# EAGLE design gest-mod (EAGLE 7.5.0)
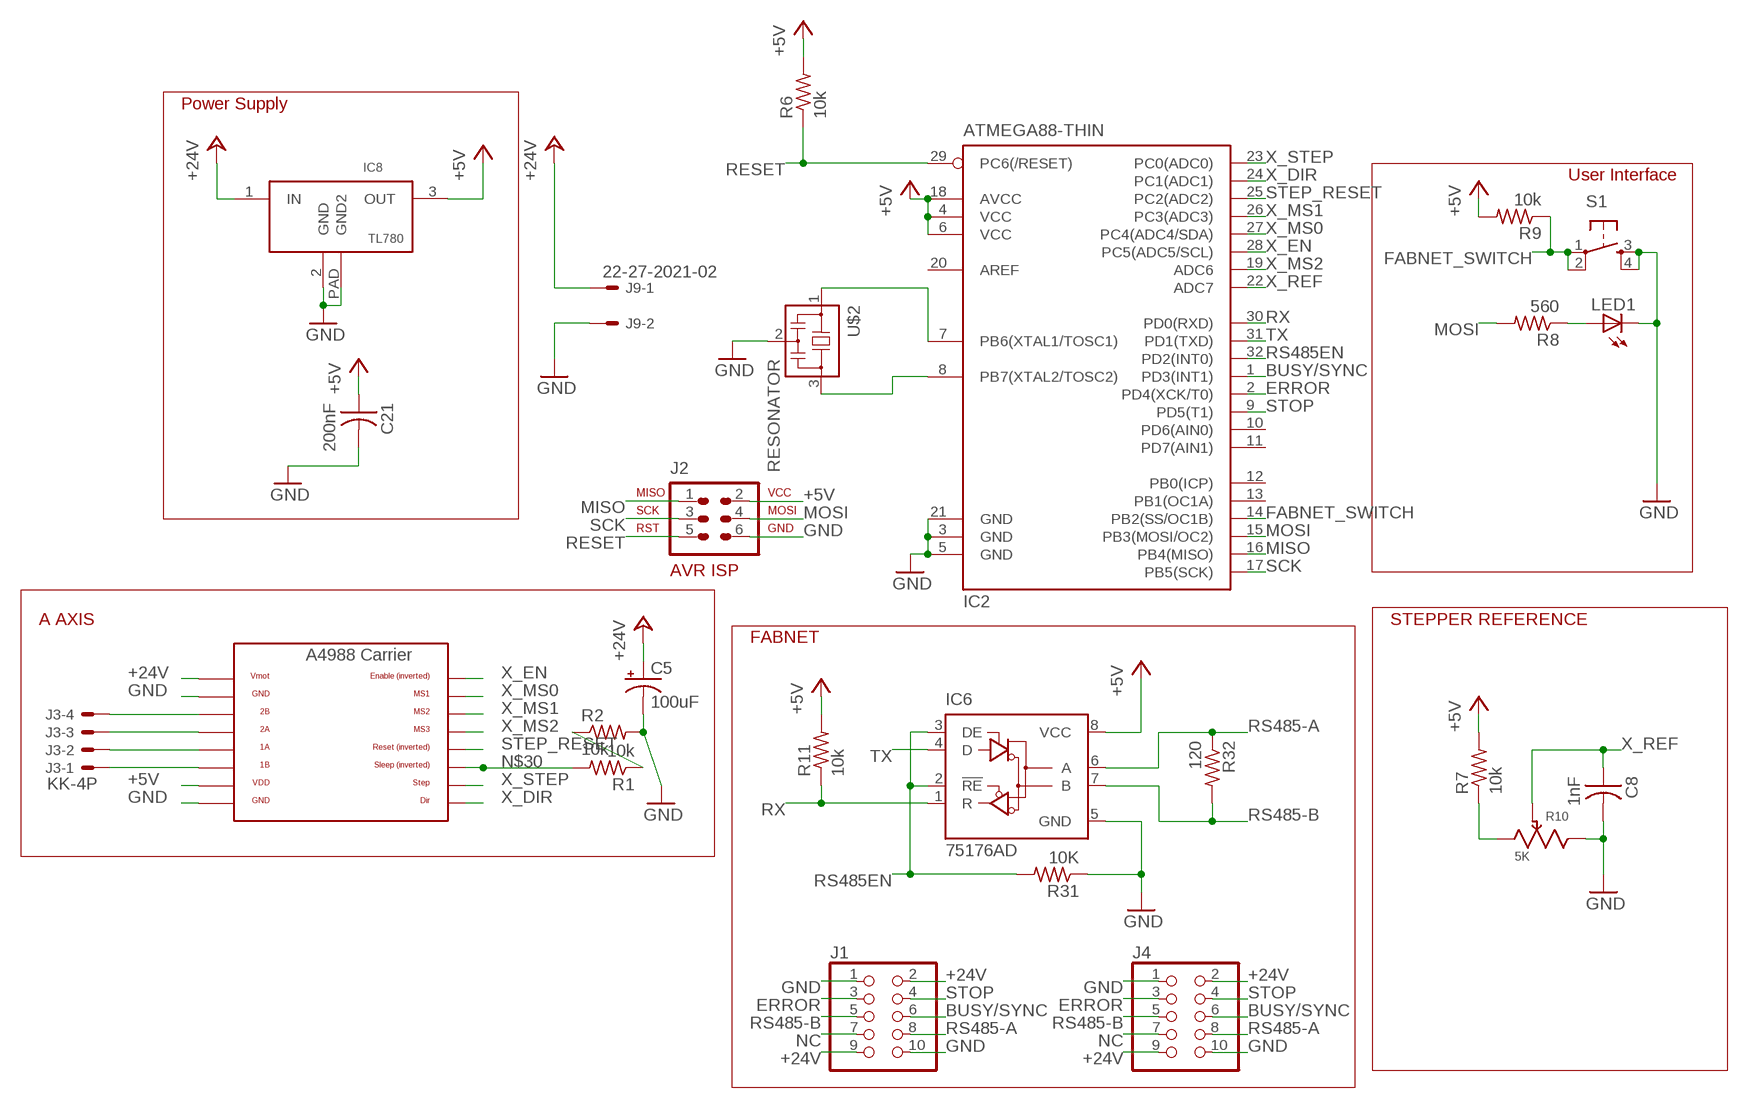
[diagram p0: schematic, sheet 1]

## Parts
C5  100uF  CPOL-USD  [PANASONIC_D]
C8  1nF  CAP-US1206FAB  [C1206FAB]
C21  200nF  CAP-US1206FAB  [C1206FAB]
IC2  ATMEGA88-THIN  [TQFP32-08THIN]
IC6  75176AD  [D_R-PDSO-G8]
IC8  TL780_VREG  [D2PAK-3]
J1  PINHEAD_PINHD-2X5  [PINHEAD_2X05]
J2  AVR-7_AVR-ISP-6VERT  [AVR-7_AVR-ISP-6]
J3  KK-4P  22-05-7048-04  [7395-04]
J4  PINHEAD_PINHD-2X5  [PINHEAD_2X05]
J9  22-27-2021-02  [6410-02]
LED1  LEDCHIPLED_1206  [CHIPLED_1206]
R1  10k  RES-US1206FAB  [R1206FAB]
R2  10k  RES-US1206FAB  [R1206FAB]
R6  10k  RES-US1206FAB  [R1206FAB]
R7  10k  RES-US1206FAB  [R1206FAB]
R8  560  RES-US1206FAB  [R1206FAB]
R9  10k  RES-US1206FAB  [R1206FAB]
R10  5K  BOURN_POT  [BOURN_TRIM]
R11  10k  RES-US1206FAB  [R1206FAB]
R31  10K  RES-US1206FAB  [R1206FAB]
R32  120  RES-US1206FAB  [R1206FAB]
S1  6MM_SWITCH6MM_SWITCH  [6MM_SWITCH]
U$2  RESONATOR  [EFOBM]
U$5  REPRAPJR_A4988BREAKOUT  [REPRAPJR_A4988BREAKOUT]

## Nets
+5V: C21.1 IC2.4(VCC) IC2.6(VCC) IC2.18(AVCC) IC6.8(VCC) IC8.3(OUT) J2.2 R6.2 R7.2 R9.2 R11.2 U$5.VDD
+24V: C5.+ IC8.1(IN) J1.2 J1.9 J4.2 J4.9 J9.1 U$5.VMOT
BUSY/SYNC: IC2.1(PD3(INT1)) J1.6 J4.6
ERROR: IC2.2(PD4(XCK/T0)) J1.3 J4.3
FABNET_SWITCH: IC2.14(PB2(SS/OC1B)) R9.1 S1.1(P) S1.2(P1)
GND: C5.- C8.2 C21.2 IC2.3(GND) IC2.5(GND) IC2.21(GND) IC6.5(GND) IC8.2(GND) IC8.PAD(GND2) J1.1 J1.10 J2.6 J4.1 J4.10 J9.2 LED1.C R2.2 R10.3 R31.1 S1.3(S) S1.4(S1) U$2.2 U$5.GND U$5.GND@0(GND)
MISO: IC2.16(PB4(MISO)) J2.1
MOSI: IC2.15(PB3(MOSI/OC2)) J2.4 R8.2
N2354: R7.1 R10.1
N$1: IC2.7(PB6(XTAL1/TOSC1)) U$2.1
N$2: IC2.8(PB7(XTAL2/TOSC2)) U$2.3
N$3: J3.3 U$5.2A
N$4: J3.4 U$5.2B
N$5: LED1.A R8.1
N$6: R1.1 R2.1
N$7: J3.2 U$5.1A
N$8: J3.1 U$5.1B
N$30: R1.2 U$5.SLP(SLEEP)
NC: J1.7 J4.7
RESET: IC2.29(PC6(/RESET)) J2.5 R6.1
RS485-A: IC6.6(A) J1.8 J4.8 R32.1
RS485-B: IC6.7(B) J1.5 J4.5 R32.2
RS485EN: IC2.32(PD2(INT0)) IC6.2(!RE) IC6.3(DE) R31.2
RX: IC2.30(PD0(RXD)) IC6.1(R) R11.1
SCK: IC2.17(PB5(SCK)) J2.3
STEP_RESET: IC2.25(PC2(ADC2)) U$5.RST
STOP: IC2.9(PD5(T1)) J1.4 J4.4
TX: IC2.31(PD1(TXD)) IC6.4(D)
X_DIR: IC2.24(PC1(ADC1)) U$5.DIR
X_EN: IC2.28(PC5(ADC5/SCL)) U$5.EN
X_MS0: IC2.27(PC4(ADC4/SDA)) U$5.MS1
X_MS1: IC2.26(PC3(ADC3)) U$5.MS2
X_MS2: IC2.19(ADC6) U$5.MS3
X_REF: C8.1 IC2.22(ADC7) R10.2
X_STEP: IC2.23(PC0(ADC0)) U$5.STEP
Unconnected: IC2.10(PD6(AIN0)) IC2.11(PD7(AIN1)) IC2.12(PB0(ICP)) IC2.13(PB1(OC1A)) IC2.20(AREF)

## Notes on the sheet
- Power Supply
- User Interface
- A AXIS | STEPPER REFERENCE
- FABNET

## Library data of the parts
C5 = rcl:CPOL-US: POLARIZED CAPACITOR, American symbol
C8 C21 = fab:CAP-US
IC2 = fab:ATMEGA88-THIN
IC6 = 751xx:75176A: DIFFERENTIAL BUS TRANSCEIVER Source: http://focus.ti.com/lit/ds/symlink/sn75176a.pdf
IC8 = MtMM:TL780_VREG
J1 J4 = fork0.1:PINHEAD_PINHD-2X5: PIN HEADER
J2 = fork0.1:AVR-7_AVR-ISP-6: AVR ISP-6 Serial Programming Header
J3 = con-molex:22-?-04: CONNECTOR wire to board 2.54 mm (.1 inch) pitch header; OC_FARNELL: unknown; OC_NEWARK: unknown
J9 = con-molex:22-?-02: CONNECTOR wire to board 2.54 mm (.1 inch) pitch header; OC_FARNELL: unknown; OC_NEWARK: unknown
LED1 = led:LED: LED OSRAM: - CHIPLED LG R971, LG N971, LY N971, LG Q971, LY Q971, LO R971, LY R971 LH N974, LH R974 LS Q976, LO Q976, LY Q976 LO Q996 - Hyper CHIPLED LW Q18S LB Q993, LB Q99A, LB R99A - SideLED LS A670, LO A670, LY A670, LG A670, LP A670 LB A673, LV A673, LT A673, LW A673 LH A674 LY A675 LS A676, LA A676, LO A676, LY A676, LW A676 LS A679, LY A679, LG A679 - Hyper Micro SIDELED® LS Y876, LA Y876, LO Y876, LY Y876 LT Y87S - SmartLED LW L88C, LW L88S LB L89C, LB L89S, LG L890 LS L89K, LO L89K, LY L89K LS L896, LA L896, LO L896, LY L896 - TOPLED LS T670, LO T670, LY T670, LG T670, LP T670 LSG T670, LSP T670, LSY T670, LOP T670, LYG T670 LG T671, LOG T671, LSG T671 LB T673, LV T673, LT T673, LW T673 LH T674 LS T676, LA T676, LO T676, LY T676, LB T676, LH T676, LSB T676, LW T676 LB T67C, LV T67C, LT T67C, LS T67K, LO T67K, LY T67K, LW E67C LS E67B, LA E67B, LO E67B, LY E67B, LB E67C, LV E67C, LT E67C LW T67C LS T679, LY T679, LG T679 LS T770, LO T770, LY T770, LG T770, LP T770 LB T773, LV T773, LT T773, LW T773 LH T774 LS E675, LA E675, LY E675, LS T675 LS T776, LA T776, LO T776, LY T776, LB T776 LHGB T686 LT T68C, LB T68C - Hyper Mini TOPLED® LB M676 - Mini TOPLED Santana® LG M470 LS M47K, LO M47K, LY M47K Source: http://www.osram.convergy.de LUXEON: - LUMILED® LXK2-PW12-R00, LXK2-PW12-S00, LXK2-PW14-U00, LXK2-PW14-V00 LXK2-PM12-R00, LXK2-PM12-S00, LXK2-PM14-U00 LXK2-PE12-Q00, LXK2-PE12-R00, LXK2-PE12-S00, LXK2-PE14-T00, LXK2-PE14-U00 LXK2-PB12-K00, LXK2-PB12-L00, LXK2-PB12-M00, LXK2-PB14-N00, LXK2-PB14-P00, LXK2-PB14-Q00 LXK2-PR12-L00, LXK2-PR12-M00, LXK2-PR14-Q00, LXK2-PR14-R00 LXK2-PD12-Q00, LXK2-PD12-R00, LXK2-PD12-S00 LXK2-PH12-R00, LXK2-PH12-S00 LXK2-PL12-P00, LXK2-PL12-Q00, LXK2-PL12-R00 Source: www.luxeon.com KINGBRIGHT: KA-3528ASYC Source: www.kingbright.com
R1 R2 R6-R9 R11 R31 R32 = fab:RES-US: Resistor (US Symbol) Variants with postfix FAB are widened to allow the routing of internal traces
R10 = unitoffab:BOURN_POT
S1 = fab:6MM_SWITCH: OMRON SWITCH
U$2 = fab:RESONATOR
U$5 = fork0.1:REPRAPJR_A4988BREAKOUT

## Board
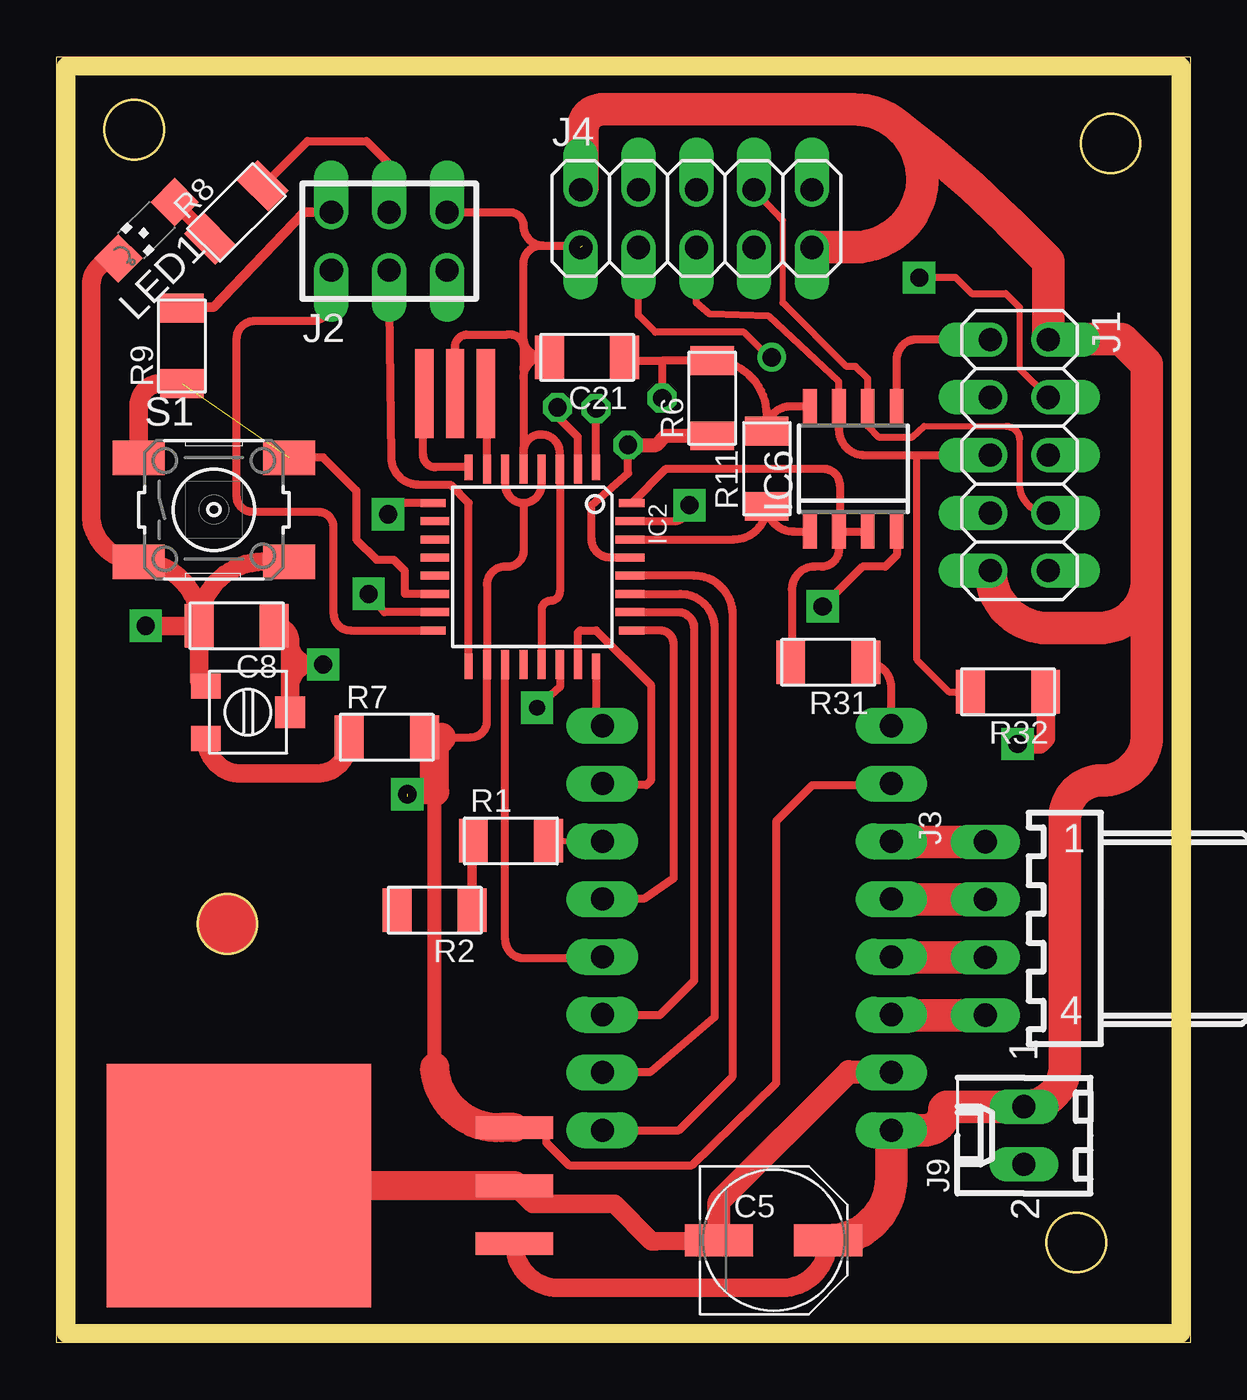
[diagram p1: board, top side]
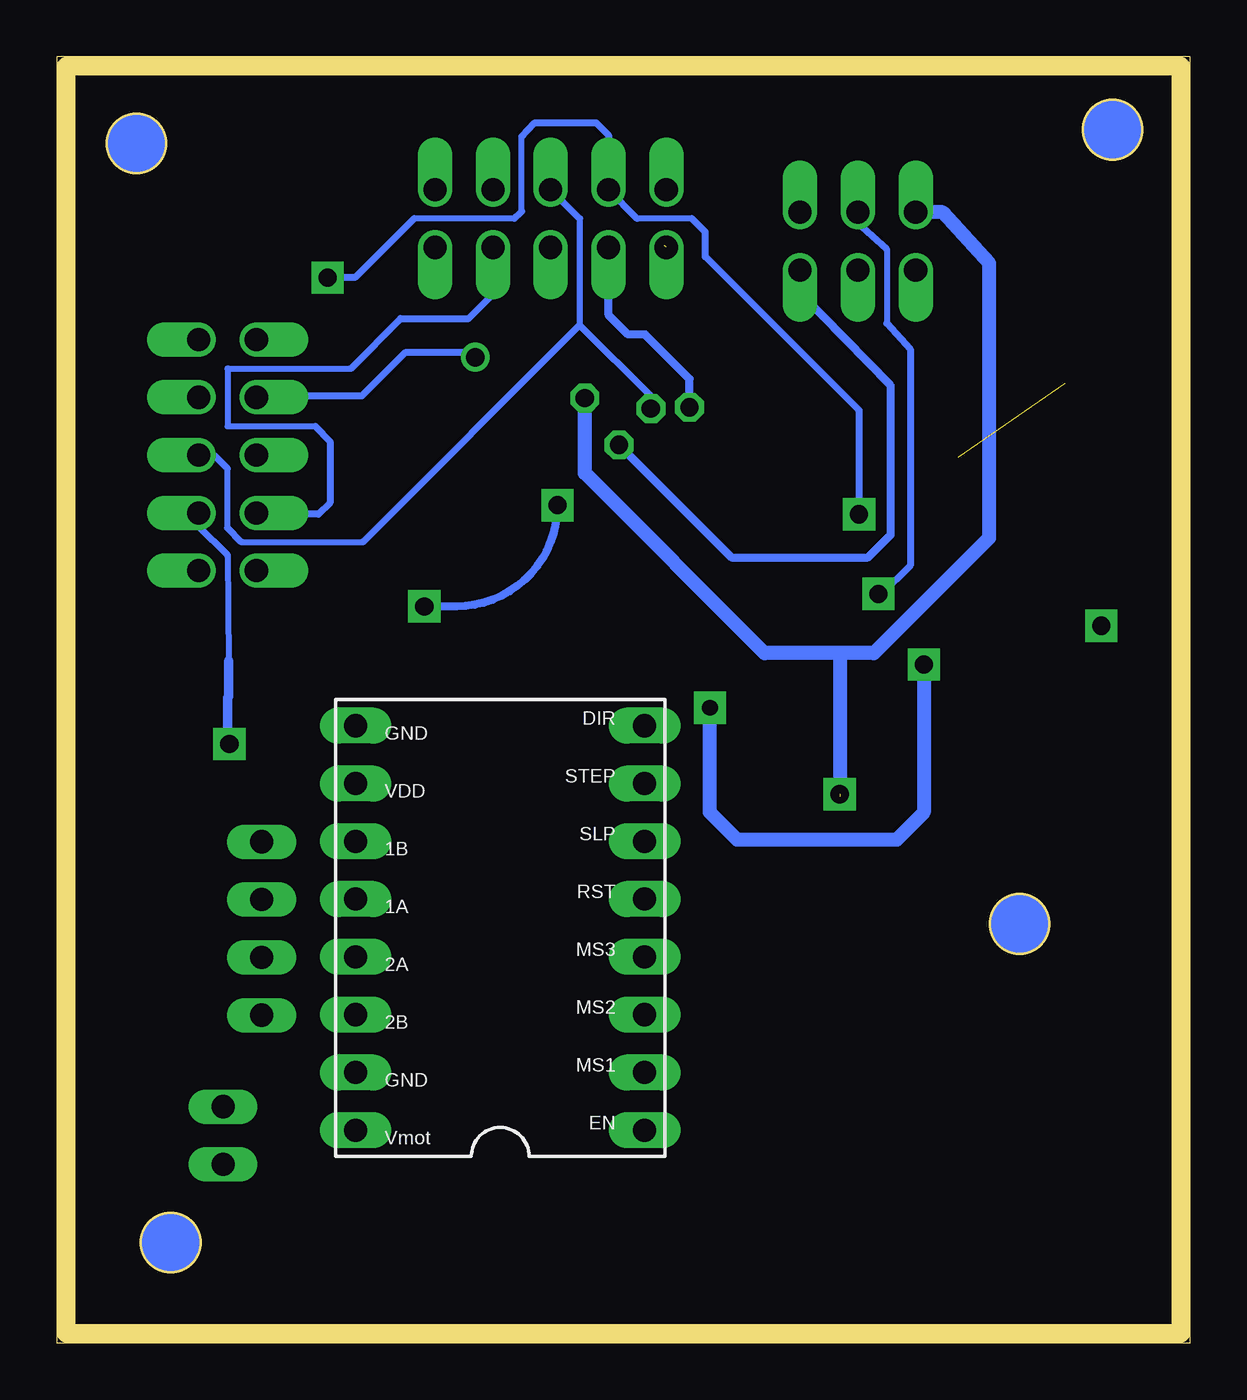
[diagram p2: board, bottom side, seen from below]

Size 49.8 x 56.5 mm. Coordinates in mm from the lower left corner, seen from the top.
Copper layers (1*16): Top 0.035mm / dielectric 1.5mm / Bottom 0.035mm
Design rules "default *": minimum track width 0.25mm, minimum drill 0.4mm, track to track 0.4mm, track to pad 0.4mm, pad to pad 0.4mm, via to via 0.4mm, smd to smd 0mil, copper to edge 1mm, drill to drill 0.2mm, minimum pad ring 10mil, minimum via ring 8mil, stop-mask expansion 4mil, vias tented up to drill 0mil, thermal gap 0mil
Milling: area 43.5,3.1 to 46.1,5.7; area 6.2,17.1 to 8.8,19.7; area 45,51.4 to 47.6,54; area 2.1,52 to 4.7,54.6; 4 lines

### Footprints (pad centres in the part's own frame; a part is rotated, then mirrored left to right if it is on the bottom)
PANASONIC_D = smd 3 x 1.4: + 2.4,0; - -2.4,0
C1206FAB = smd 1.27 x 1.905: 1 -1.651,0; 2 1.651,0
TQFP32-08THIN = smd 1.118 x 0.356: 1 -4.369,2.8; 8 -4.369,-2.8; 17 4.369,-2.8; 24 4.369,2.8 | smd 1.27 x 0.356: 2 -4.293,2; 3 -4.293,1.2; 4 -4.293,0.4; 5 -4.293,-0.4; 6 -4.293,-1.2; 7 -4.293,-2; 18 4.293,-2; 19 4.293,-1.2; 20 4.293,-0.4; 21 4.293,0.4; 22 4.293,1.2; 23 4.293,2 | smd 0.356 x 1.118: 9 -2.8,-4.369; 16 2.8,-4.369; 25 2.8,4.369; 32 -2.8,4.369 | smd 0.356 x 1.27: 10 -2,-4.293; 14 1.2,-4.293; 15 2,-4.293; 26 2,4.293; 27 1.2,4.293; 31 -2,4.293 | smd 0.35 x 1.27: 11 -1.2,-4.293; 12 -0.4,-4.293; 13 0.4,-4.293; 28 0.4,4.293; 29 -0.4,4.293; 30 -1.2,4.293
D_R-PDSO-G8 = smd 0.6 x 1.5: 1 -1.905,-2.75; 2 -0.635,-2.75; 3 0.635,-2.75; 4 1.905,-2.75; 5 1.905,2.75; 6 0.635,2.75; 7 -0.635,2.75; 8 -1.905,2.75
D2PAK-3 = smd 1 x 3.4: 1 -2.55,-10.6; 2 0,-10.6; 3 2.55,-10.6 | smd 10.7 x 11.6: PAD 0,1.5
PINHEAD_2X05 = drill 1.016 pad 1.27 offset: 1 -5.08,-1.27; 2 -5.08,1.27; 3 -2.54,-1.27; 4 -2.54,1.27; 5 0,-1.27; 6 0,1.27; 7 2.54,-1.27; 8 2.54,1.27; 9 5.08,-1.27; 10 5.08,1.27
AVR-7_AVR-ISP-6 = drill 1.016 pad 1.27 offset: 1 -2.54,-1.27; 2 -2.54,1.27; 3 0,-1.27; 4 0,1.27; 5 2.54,-1.27; 6 2.54,1.27
7395-04 = drill 1.016 long: 1 3.81,0; 2 1.27,0; 3 -1.27,0; 4 -3.81,0
6410-02 = drill 1.016 long: 1 1.27,0; 2 -1.27,0
CHIPLED_1206 = smd 1.5 x 1.5: A 0,-1.75; C 0,1.75
R1206FAB = smd 1.27 x 1.905: 1 -1.651,0; 2 1.651,0
BOURN_TRIM = smd 1.1 x 1.3: 1 1.15,-1.85; 3 -1.15,-1.85 | smd 1.4 x 1.3: 2 0,1.85
6MM_SWITCH = smd 2.286 x 1.524: 1 -3.302,2.286; 2 3.302,2.286; 3 -3.302,-2.286; 4 3.302,-2.286
EFOBM = smd 0.8 x 3.9: 1 -1.35,0; 2 0,0; 3 1.35,0
REPRAPJR_A4988BREAKOUT = drill 1.016 pad 1.575 long: 1A 8.89,1.27; 1B 11.43,1.27; 2A 6.35,1.27; 2B 3.81,1.27; DIR 16.51,-11.43; EN -1.27,-11.43; GND 16.51,1.27; GND@0 1.27,1.27; MS1 1.27,-11.43; MS2 3.81,-11.43; MS3 6.35,-11.43; RST 8.89,-11.43; SLP 11.43,-11.43; STEP 13.97,-11.43; VDD 13.97,1.27; VMOT -1.27,1.27

### Placement (x,y rotation side)
C5  31.5,4.5 0 top
C8  7.9,31.5 180 top
C21  23.3,43.3 180 top
IC2  20.9,34.1 270 top
IC6  35,38.4 0 top
IC8  9.5,6.9 90 top
J1  42.3,39 270 top
J2  14.6,48.4 0 top
J3  40.8,18.2 90 top
J4  28.1,49.4 0 top
J9  42.5,9.1 90 top
LED1  3.94,48.88 135 top
R1  19.95,22.05 0 top
R2  16.6,19 180 top
R6  28.8,41.5 90 top
R7  14.5,26.6 0 top
R8  7.89,49.67 45 top
R9  5.5,43.8 90 top
R10  8.4,27.7 270 top
R11  31.2,38.4 90 top
R31  33.9,29.9 180 top
R32  41.8,28.6 180 top
S1  6.9,36.6 0 top
U$2  17.5,41.7 180 top
U$5  35.4,10.6 90 bottom

### Tracks (layer width: path | path; a pad name or v marks a point on that pad's centre or on a via)
+5V  (via drill 0.8 pad 1.27, 0.8 pad 1.42)  (1 unrouted)
  Top 0.35: IC2.6 19.7,37.7 arc90 20.5,36.9 | 20.5,36.9 arc90 21.3,37.7 IC2.4 | 20.5,36.9 20.5,34.7 arc-90 19.7,34.1 arc90 18.9,33.3 IC2.18 18.9,27.3 arc-90 18.2,26.6 16.9,26.6 R7.2 | IC6.8 32.2,41.15 arc90 R11.2 31.2,40.75 arc90 R6.2 26.6,43.15 | IC8.3 arc90 20.15,9.4 21.5,9.4 21.5,8.8 22.5,7.8 27.9,7.8 31.6,11.4 31.6,22.9 33.2,24.5 36.6,24.5 arc90 U$5.VDD | C21.1 arc90 25.1,43.15 26.6,43.15 | 26.6,43.15 v26.6,41.5
  Top 0.406: J2.2 10.87,49.67 6.9,45.5 5.55,45.5 R9.2
  Top 0.61: 16.6,12.1 16.6,24.2
  Top 1.016: v15.4,24.1 16.6,24.2
  Top 1.27: IC8.3 19.55,9.45 arc-90 16.6,12.1 | 16.6,24.2 16.6,26.5 arc90 16.9,26.6
  Bottom 0.61: 15.4,30.3 15.4,24 | 15.4,30.3 13.9,30.3 8.83,35.38 8.83,47.43 10.87,49.67 J2.2 | 15.4,30.3 18.7,30.3 26.6,38.2 v26.6,41.5
+24V
  Top 0.813: IC8.1 arc90 22.05,2.4 31.86,2.4 arc90 C5.+
  Top 1.422: 47.9,33.5 47.9,43 46.8,44.1 43.59,44.1 J1.2 43.57,47.53 41.8,49.3 arc9 36.8,53.6 arc36 35,54.2 | C5.+ arc90 36.67,7.21 U$5.VMOT 38.13,9.33 arc90 39,10.2 arc-90 39.17,10.37 J9.1 arc90 44.3,12.17 44.3,23.1 arc-90 45.9,24.7 arc90 47.9,26.7 47.9,33.5 | 35,54.2 24,54.2 arc90 23.1,53.3 23.1,50.75 J4.2 | J4.9 35.03,48.13 arc179 35,54.2 | 47.9,33.5 arc-90 45.8,31.4 43.55,31.4 arc-90 J1.9
BUSY/SYNC  (via drill 0.8 pad 1.27)
  Top 0.35: IC2.1 v23.7,41.05
  Bottom 0.254: 26.83,49.4 26.83,44.72 | 41.7,35.19 36.35,35.19 | 42.3,35.8 42.3,38.4
  Bottom 0.305: v23.7,41.05 23.7,41.59 26.83,44.72 36.35,35.19 | J1.6 42.87,38.97 42.3,38.4 | 41.7,35.19 42.3,35.8 | 26.83,49.4 J4.6
ERROR  (via drill 0.8 pad 1.27)
  Top 0.305: v31.41,43.3 31.3,43.3 30.2,44.4 26.3,44.4 25.55,45.15 25.55,46.42 J4.3
  Top 0.35: IC2.2 22.9,39.8 22,40.7 v22,41.1
  Bottom 0.305: J1.3 39.57,41.6 36.4,41.6 34.5,43.5 31.7,43.5 v31.41,43.3
  Bottom 0.35: v22,41.1 22,42.35 23.95,44.3 24.7,44.3 25.55,45.15 25.55,46.42 J4.3
FABNET_SWITCH  (1 unrouted)
  Top 0.35: IC2.14 15.3,32.9 15.3,33.9 14.8,34.4 14.05,34.4 13.15,35.3 13.15,37.45 11.7,38.9 10.22,38.9 S1.2
  Top 0.813: R9.1 4.56,42.15 arc90 3.6,41.19 S1.1
GND  (via drill 0.8 pad 1.42)  (1 unrouted)
  Top 0.35: U$2.2 17.5,43.7 arc-90 18,44.3 19.8,44.3 arc-90 20.5,43.8 | 20.5,43.8 20.5,42.8 | 20.5,42.8 20.5,42.4 | 20.5,42.4 20.5,39 | 20.5,39 IC2.5 | IC2.21 21.3,32.2 arc-90 21.7,32.6 arc90 22.1,33 IC2.3 22.1,39.1 arc90 21.3,39.9 arc103 20.5,39 | J1.1 37.78,44.08 arc90 36.9,43.2 IC6.5 arc90 IC6.5 | U$5.GND 36.67,28.78 arc90 R31.1 | 20.5,43.8 20.5,44.2 | 20.5,44.2 20.5,47.3 arc-90 21.2,48.2 21.4,48.2 | 21.4,43.3 C21.2 21.8,43.3 | 21.4,43.3 arc-90 20.5,44.2 | 21.7,43.3 21,43.3 arc90 20.5,42.8 | 21.4,43.3 arc90 20.5,42.4 | J2.6 19.93,49.67 arc-90 20.5,49.1 arc90 21.4,48.2 | 21.4,48.2 23.1,48.2
  Top 0.813: C5.- 26.34,4.46 26.14,4.46 24.5,6.1 20.9,6.1 IC8.2 | 36.53,11.87 U$5.GND@0 | R10.3 arc-90 6.25,29.15 C8.2 | C8.2 6.25,31.66 arc90 S1.3 arc-90 1.5,36.41 1.5,46.44 arc-90 LED1.C | C8.2 arc-90 9.06,34.31 S1.4 | v3.9,31.5 C8.2
  Top 1.016: C5.- 29.1,6.2 34.8,11.9 36.64,11.9 U$5.GND@0
  Top 1.27: IC8.2 IC8.PAD
  pour Bottom (isolate 0.813): 1.7,1.2 48.6,1.2 48.6,55.3 1.7,55.3
  pour Top: 2.2,12.2 15,12.2 15,22.7 12.9,22.7 12.9,23.8 2.2,23.8
MISO
  Top 0.35: IC2.16 12.9,31.3 arc-90 12.16,32.04 12.16,35.84 arc90 11.5,36.5 8.6,36.5 arc-90 7.9,37.2 7.9,44.1 arc-90 8.7,44.9 11.2,44.9 arc90 12.1,45.8 12.1,46.77 arc-90 J2.1
MOSI  (via drill 0.8 pad 1.42)
  Top 0.35: IC2.15 14.4,32.1 v13.7,32.9 | R8.2 11.02,52.8 13.6,52.8 14.6,51.8 J2.4
  Bottom 0.254: 13.33,48.04 13.33,44.79
  Bottom 0.305: 13.45,33 v13.7,32.9 13.6,32.85 12.3,34.15 12.3,43.65 13.33,44.79 | 13.33,48.04 14.6,49.2 J2.4
N2354
  Top 0.813: R10.1 arc90 8.1,25 11.4,25 arc90 12.85,26.45 R7.1
N$1
  Top 0.35: IC2.7 18.9,40.5 arc-90 18.85,40.55 U$2.1
N$2
  Top 0.35: IC2.8 16.63,38.47 arc-90 16.1,39 16.1,41.65 arc-90 U$2.3
N$3
  Top 1.422: U$5.2A arc90 36.69,16.93 J3.3
N$4
  Top 1.422: U$5.2B arc90 36.69,14.39 J3.4
N$5
  Top 0.61: LED1.A 6.72,48.58 R8.1
N$6
  Top 0.254: R1.1 18.25,22.05
  Top 0.406: 18.25,22.05 R2.1
N$7
  Top 1.422: U$5.1A arc90 36.69,19.47 J3.2
N$8
  Top 1.422: U$5.1B arc90 36.69,22.01 J3.1
N$30
  Top 0.254: R1.2 23.97,22.05 U$5.SLP
NC
  Bottom 0.254: 42.27,42.81 36.88,42.81 | 38.44,40.27 42.3,40.27 42.3,42.8 42.27,42.81 | 42.3,42.8 42.27,42.81
  Bottom 0.305: 36.88,42.81 34.7,45 31.7,45 30.6,46.1 30.6,48.09 J4.7 | 38.44,40.27 37.8,39.6 37.8,36.9 38.3,36.4 40.97,36.4 J1.7
RESET  (via drill 0.8 pad 1.27)
  Top 0.35: IC2.29 24.3,34.5 arc-90 23.5,35.3 23.5,36.8 25.1,38.2 v25.1,39.45
  Top 0.61: R6.1 26.75,39.85 26.35,39.45 v25.1,39.45
  Bottom 0.35: v25.1,39.45 20.15,34.5 14.15,34.5 13.15,35.5 13.15,42.05 17.14,46.14 J2.5
RS485-A  (via drill 0.8 pad 1.42)
  Top 0.254: 31.9,45.7 31.9,49.31 | 38.11,40.27 41.71,40.27 | 42.3,39.7 42.3,37.73
  Top 0.305: 31.9,45.7 34.7,42.9 35.1,42.9 35.63,42.37 IC6.6 35.63,40.27 36.1,39.8 37.6,39.8 38.11,40.27 | 41.71,40.27 arc-90 42.3,39.7 | 42.3,37.73 arc90 J1.8 | 31.9,49.31 J4.8
  Top 0.813: R32.1 43.45,26.55 43.2,26.29 42.23,26.29 v42.22,26.31
  Bottom 0.254: 42.3,34.6 42.25,29.95
  Bottom 0.305: 42.25,28.4 42.3,28.35 | J1.8 43.57,35.87 42.3,34.6
  Bottom 0.406: 42.3,28.35 42.3,26.39 v42.22,26.31 | 42.25,29.95 42.25,28.4
RS485-B
  Top 0.305: IC6.7 34.36,42.23 31.3,45.1 28.7,45.2 28.1,45.7 J4.5 | 37.7,39 37.8,38.9 37.8,30 39.2,28.6 R32.2
  Top 0.35: IC6.7 34.36,40.14 arc90 35.5,39 37.7,39 J1.5
RS485EN
  Top 0.35: IC6.2 IC6.3 | IC6.2 34.36,34.87 arc-90 33.6,34.1 33.3,34.1 arc90 32.3,33.1 32.3,30.7 arc90 32.25,30.65 R31.2 | IC2.32 26.77,38.4 33.7,38.4 arc-90 34.4,37.7 34.4,35.69 arc-90 IC6.2
RX
  Top 0.35: IC6.1 32.4,35.65 arc-90 R11.1 arc-90 29.75,35.3 IC2.30
SCK
  Top 0.35: IC2.17 18.1,36.9 17.3,37.7 15.9,37.7 arc-90 14.7,38.9 J2.3
STEP_RESET
  Top 0.35: 25.6,31.3 IC2.25 26.5,31.3 arc-90 27.1,30.7 27.1,20.4 25.8,19.5 U$5.RST arc90 U$5.RST
STOP  (via drill 0.8 pad 1.42)
  Top 0.254: 42.3,45.5 42.3,42.81
  Top 0.305: v37.9,46.8 39.5,46.8 40.2,46.1 41.7,46.1 42.3,45.5 | 42.3,42.81 J1.4
  Top 0.35: IC2.9 15.05,36.9 v14.55,36.4
  Bottom 0.254: 29.7,49.4 34.1,49.4 | 21.9,49.4 24.3,49.4 | 29.37,49.7 29.37,53
  Bottom 0.305: v14.55,36.4 14.55,40.97 21.3,47.72 21.3,48.8 21.9,49.4 | 34.1,49.4 36.7,46.8 v37.9,46.8 | 24.3,49.4 J4.4 25.56,53.06 26.1,53.6 28.8,53.6 29.37,53 | 29.7,49.4 29.37,49.7
TX  (via drill 0.8 pad 1.42)
  Top 0.35: IC2.31 27.1,36.1 arc90 v27.8,36.8 | IC6.4 36.9,34.61 36.4,34.1 35.4,34.1 v33.65,32.35
  Bottom 0.35: v27.8,36.8 arc90 32.25,32.35 v33.65,32.35
X_DIR
  Top 0.35: IC2.24 23.7,27.38 arc90 U$5.DIR
X_EN
  Top 0.35: IC2.28 28,33.7 arc-90 29.7,32 29.7,11.7 27.33,9.33 U$5.EN
X_MS0
  Top 0.35: IC2.27 27.4,32.9 arc-90 28.9,31.4 28.9,14.3 26.1,11.9 24,11.9 arc90 U$5.MS1
X_MS1
  Top 0.35: IC2.26 27.3,32.1 arc-90 28,31.4 28,15.9 26.5,14.4 24.52,14.4 arc-90 24.51,14.41 U$5.MS2
X_MS2
  Top 0.35: IC2.19 19.7,17.7 arc90 20.5,16.9 23.92,16.9 arc90 U$5.MS3
X_REF  (via drill 0.7 pad 1.42, 0.8 pad 1.42)
  Top 0.35: IC2.22 22.1,28.8 v21.1,27.9
  Top 0.61: 11.4,29.8 arc90 10.3,28.7 | v11.7,29.8 11.4,29.8 | 11.4,29.8 arc-90 10.3,30.9 10.25,30.8
  Top 0.813: C8.1 arc-90 10.25,30.8 R10.2 | v11.7,29.8 10.85,29.8
  Bottom 0.61: v11.7,29.8 11.7,23.3 12.9,22.1 19.9,22.1 21.1,23.3 v21.1,27.9
X_STEP
  Top 0.35: IC2.23 22.9,31.2 23,31.3 23.7,31.3 26.1,28.9 26.1,24.7 25.9,24.5 24.04,24.5 U$5.STEP
(copper drawn outside any net)
  shapes: Bottom circle x4, Top circle x1